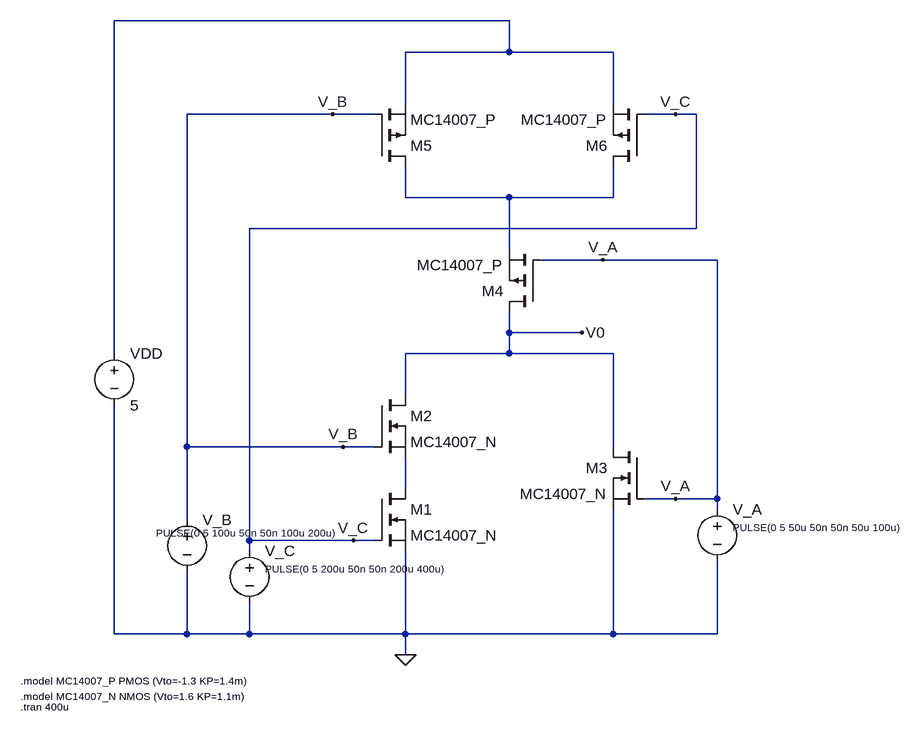
[diagram p0: schematic 1.4.1.asc]
1.4.1.asc, the LTspice schematic file:
Version 4
SHEET 1 1276 680
WIRE 528 -688 -80 -688
WIRE 528 -640 528 -688
WIRE 528 -640 368 -640
WIRE 688 -640 528 -640
WIRE 368 -560 368 -640
WIRE 688 -560 688 -640
WIRE 256 -544 32 -544
WIRE 320 -544 256 -544
WIRE 784 -544 736 -544
WIRE 816 -544 784 -544
WIRE 368 -416 368 -464
WIRE 528 -416 368 -416
WIRE 688 -416 688 -464
WIRE 688 -416 528 -416
WIRE 816 -368 816 -544
WIRE 816 -368 128 -368
WIRE 528 -336 528 -416
WIRE 672 -320 576 -320
WIRE 848 -320 672 -320
WIRE 528 -208 528 -240
WIRE 640 -208 528 -208
WIRE -80 -176 -80 -688
WIRE 528 -176 528 -208
WIRE 528 -176 368 -176
WIRE 688 -176 528 -176
WIRE 368 -112 368 -176
WIRE 32 -32 32 -544
WIRE 272 -32 32 -32
WIRE 320 -32 272 -32
WIRE 688 -32 688 -176
WIRE 368 32 368 -16
WIRE 784 48 736 48
WIRE 848 48 848 -320
WIRE 848 48 784 48
WIRE 848 64 848 48
WIRE 32 80 32 -32
WIRE 128 112 128 -368
WIRE 288 112 128 112
WIRE 320 112 288 112
WIRE 128 128 128 112
WIRE -80 256 -80 -96
WIRE 32 256 32 160
WIRE 32 256 -80 256
WIRE 128 256 128 208
WIRE 128 256 32 256
WIRE 368 256 368 128
WIRE 368 256 128 256
WIRE 688 256 688 64
WIRE 688 256 368 256
WIRE 848 256 848 144
WIRE 848 256 688 256
WIRE 368 288 368 256
FLAG 368 288 0
FLAG 288 112 V_C
FLAG 272 -32 V_B
FLAG 784 48 V_A
FLAG 640 -208 V0
FLAG 672 -320 V_A
FLAG 784 -544 V_C
FLAG 256 -544 V_B
SYMBOL voltage 32 64 R0
WINDOW 123 0 0 Left 0
WINDOW 39 0 0 Left 0
WINDOW 3 -48 36 Left 1
SYMATTR Value PULSE(0 5 100u 50n 50n 100u 200u)
SYMATTR InstName V_B
SYMBOL voltage 128 112 R0
WINDOW 123 0 0 Left 0
WINDOW 39 0 0 Left 0
WINDOW 3 24 44 Left 1
SYMATTR Value PULSE(0 5 200u 50n 50n 200u 400u)
SYMATTR InstName V_C
SYMBOL voltage -80 -192 R0
WINDOW 123 0 0 Left 0
WINDOW 39 0 0 Left 0
SYMATTR InstName VDD
SYMATTR Value 5
SYMBOL nmos 320 32 R0
SYMATTR InstName M1
SYMATTR Value MC14007_N
SYMBOL nmos 320 -112 R0
SYMATTR InstName M2
SYMATTR Value MC14007_N
SYMBOL voltage 848 48 R0
WINDOW 123 0 0 Left 0
WINDOW 39 0 0 Left 0
WINDOW 3 24 44 Left 1
SYMATTR Value PULSE(0 5 50u 50n 50n 50u 100u)
SYMATTR InstName V_A
SYMBOL nmos 736 -32 M0
SYMATTR InstName M3
SYMATTR Value MC14007_N
SYMBOL pmos 576 -240 R180
SYMATTR InstName M4
SYMATTR Value MC14007_P
SYMBOL pmos 320 -464 M180
SYMATTR InstName M5
SYMATTR Value MC14007_P
SYMBOL pmos 736 -464 R180
SYMATTR InstName M6
SYMATTR Value MC14007_P
TEXT -224 328 Left 1 !.model MC14007_P PMOS (Vto=-1.3 KP=1.4m)
TEXT -224 352 Left 1 !.model MC14007_N NMOS (Vto=1.6 KP=1.1m)
TEXT -224 368 Left 1 !.tran 400u

The netlist it stands for:
* 1.4.1.asc
V_B V_B 0 PULSE(0 5 100u 50n 50n 100u 200u)
V_C V_C 0 PULSE(0 5 200u 50n 50n 200u 400u)
VDD N001 0 5
M1 N003 V_C 0 0 MC14007_N
M2 V0 V_B N003 N003 MC14007_N
V_A V_A 0 PULSE(0 5 50u 50n 50n 50u 100u)
M3 V0 V_A 0 0 MC14007_N
M4 V0 V_A N002 N002 MC14007_P
M5 N002 V_B N001 N001 MC14007_P
M6 N002 V_C N001 N001 MC14007_P
.model NMOS NMOS
.model PMOS PMOS
.lib standard.mos
.model MC14007_P PMOS (Vto=-1.3 KP=1.4m)
.model MC14007_N NMOS (Vto=1.6 KP=1.1m)
.tran 400u
.backanno
.end

* Results of the author's LTspice run, read from the files saved beside the schematic
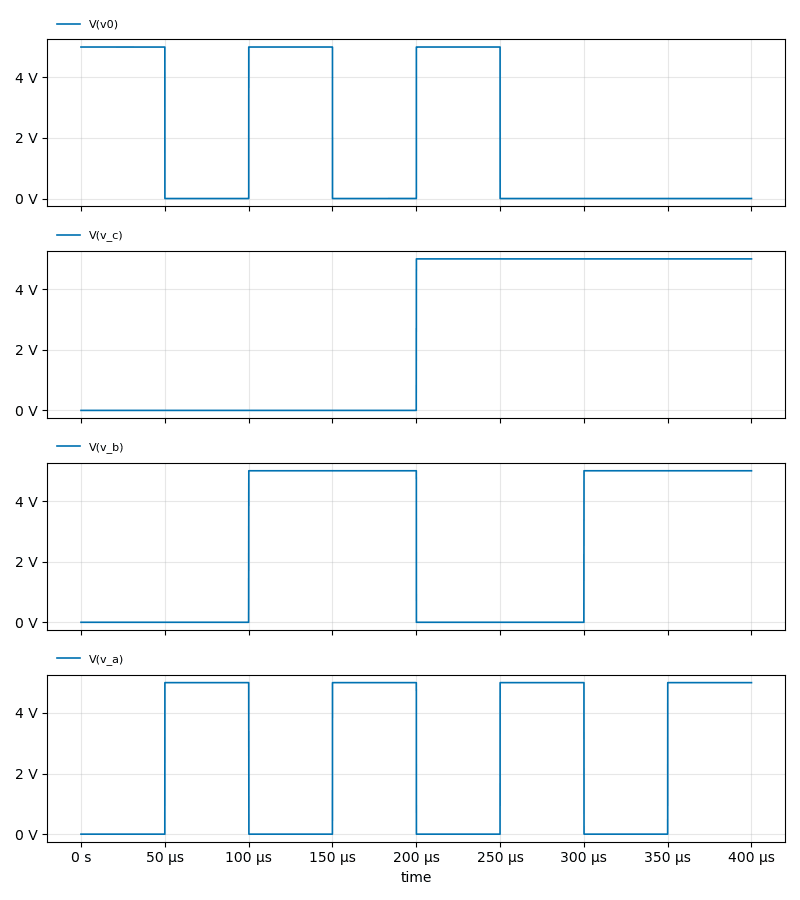
[diagram p1: Transient Analysis of 1.4.1.asc, plotted from the saved traces]
* Transient Analysis, 1 run:
*   V(v0): min 0 V, max 5 V, average 1.874 V, rms 3.061 V, last 0 V
*   V(v_c): min 0 V, max 5 V, average 2.5 V, rms 3.535 V, last 5 V
*   V(v_b): min 0 V, max 5 V, average 2.5 V, rms 3.536 V, last 5 V
*   V(v_a): min 0 V, max 5 V, average 2.502 V, rms 3.536 V, last 5 V